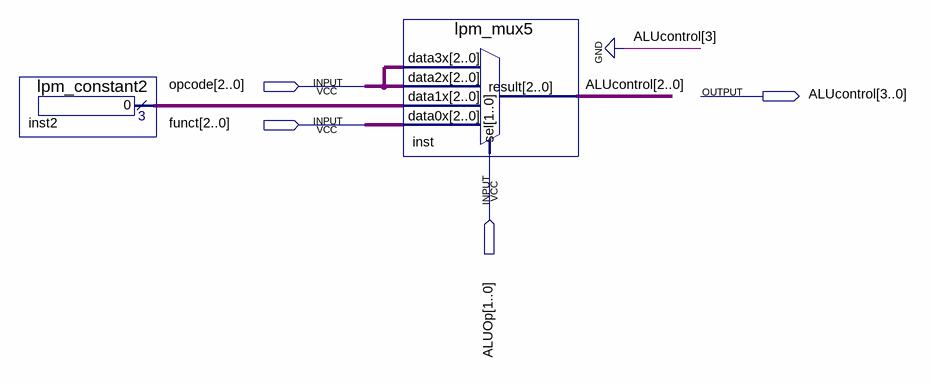
[diagram p0: schematic sheet]
// Quartus schematic ALUcontrol.bdf as structural Verilog: 2 symbols, 4 pins
module ALUcontrol (
  input  [2:0] opcode,
  input  [2:0] funct,
  input  [1:0] ALUOp,
  output [3:0] ALUcontrol
);

  wire [2:0] inst2_result;

  lpm_constant2 inst2 (.result(inst2_result));
  lpm_mux5 inst (
    .data3x(opcode), .data2x(opcode), .data1x(inst2_result), .data0x(funct), .sel(ALUOp),
    .result(ALUcontrol[2:0]));

  assign ALUcontrol[3] = 1'b0;
endmodule
